# EAGLE design CC2640_interface (EAGLE 6.6.0)

## Sheet 1 of 4
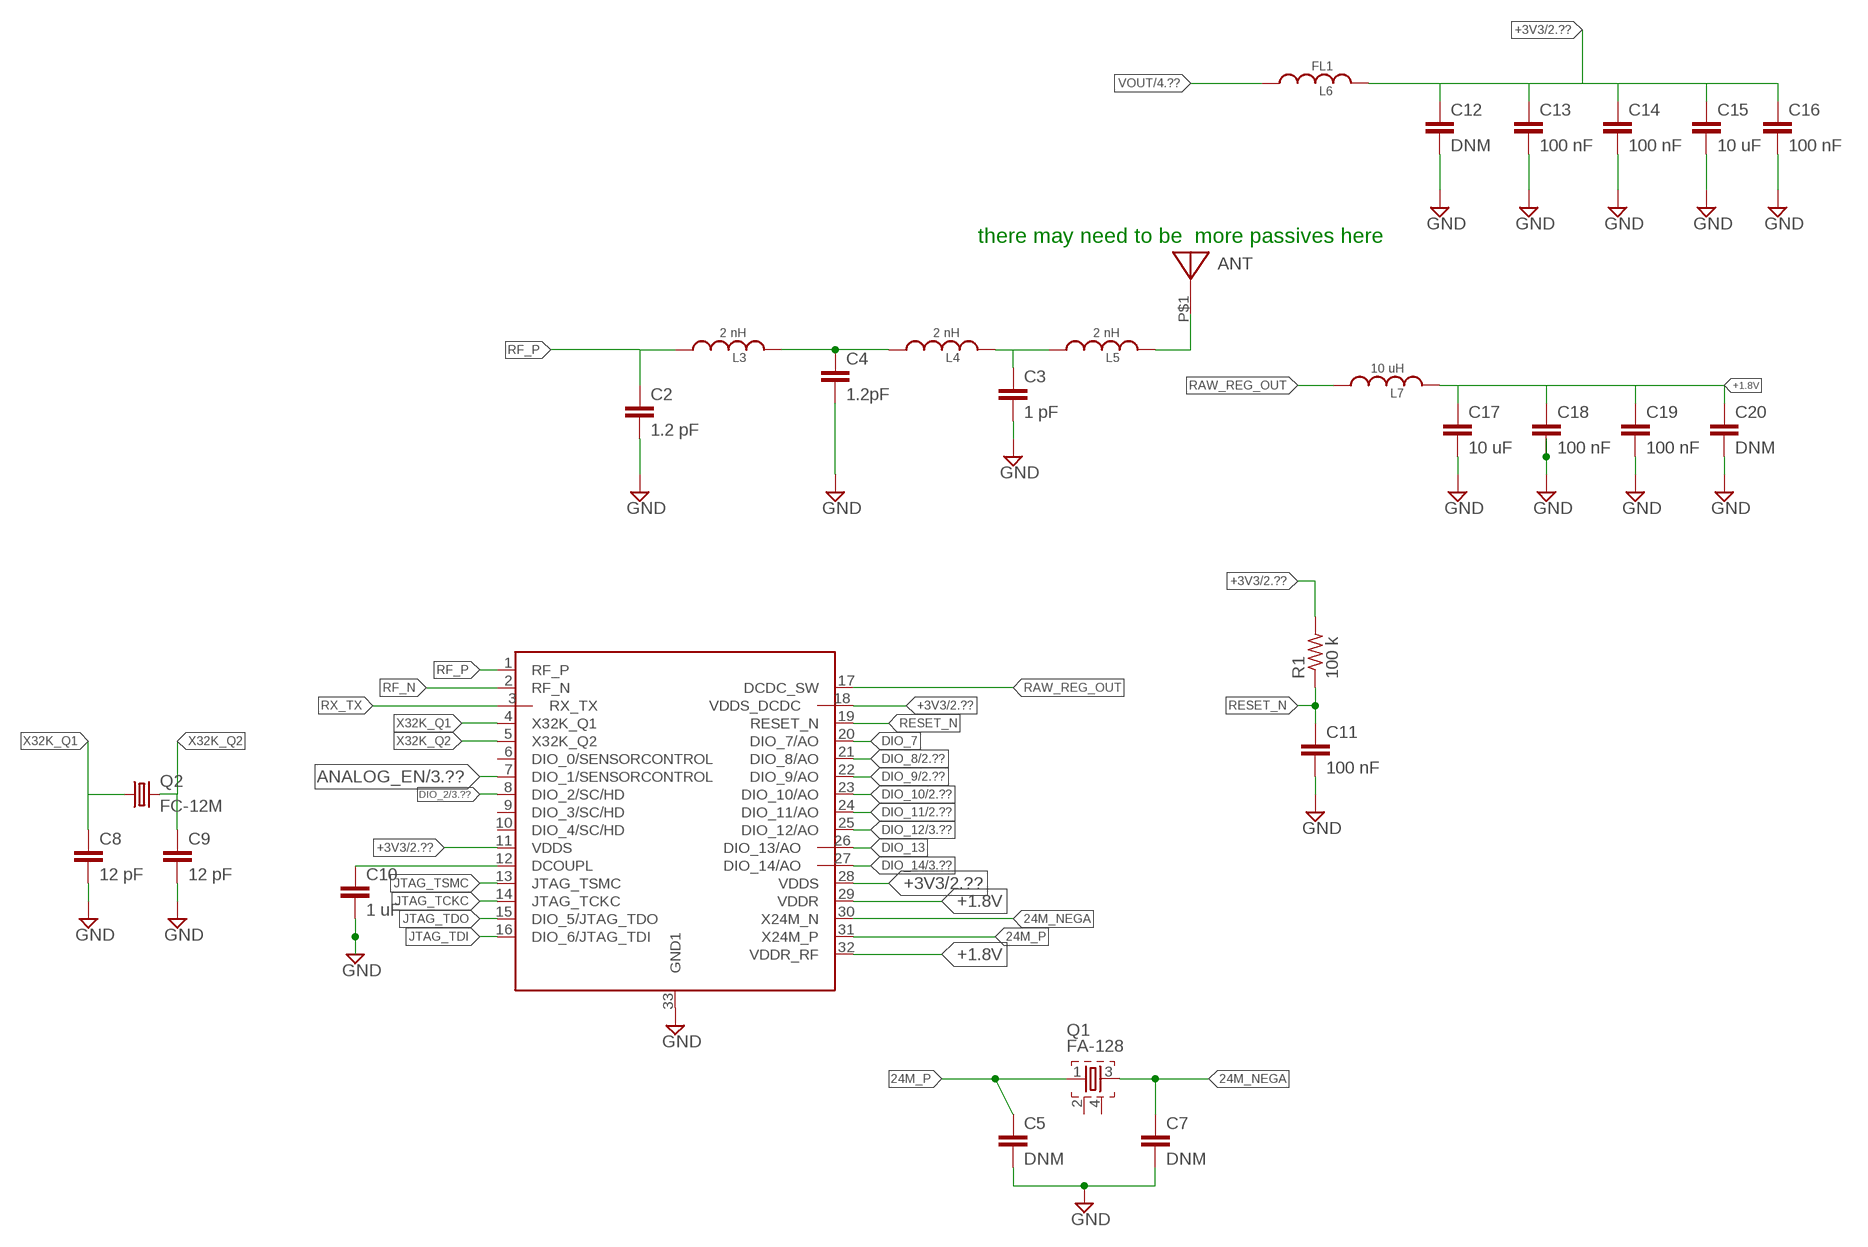
[diagram p0: schematic, sheet 1]

### Parts
ANT  2450AT18A100  [2450AT18A100]
C2  1.2 pF  C-EUC0402  [C0402]
C3  1 pF  C-EUC0402  [C0402]
C4  1.2pF  C-EUC0402  [C0402]
C5  DNM  C-EUC0402  [C0402]
C7  DNM  C-EUC0402  [C0402]
C8  12 pF  C-EUC0402  [C0402]
C9  12 pF  C-EUC0402  [C0402]
C10  1 uF  C-EUC0402  [C0402]
C11  100 nF  C-EUC0402  [C0402]
C12  DNM  C-EUC0402  [C0402]
C13  100 nF  C-EUC0402  [C0402]
C14  100 nF  C-EUC0402  [C0402]
C15  10 uF  C-EUC0402  [C0402]
C16  100 nF  C-EUC0402  [C0402]
C17  10 uF  C-EUC0402  [C0402]
C18  100 nF  C-EUC0402  [C0402]
C19  100 nF  C-EUC0402  [C0402]
C20  DNM  C-EUC0402  [C0402]
L3  2 nH  INDUCTOR0603  [0603_CAP]
L4  2 nH  INDUCTOR0603  [0603_CAP]
L5  2 nH  INDUCTOR0603  [0603_CAP]
L6  FL1  INDUCTOR0603  [0603_CAP]
L7  10 uH  INDUCTOR0603  [0603_CAP]
Q1  FA-128  [FA-128]
Q2  FC-12M  [FC-12M]
R1  100 k  R-US_R0402  [R0402@1]
U$1  CC2640-5MM  [S-PVQFN-N32]

### Nets
24M_NEGA: C7.1 Q1.3 U$1.30(X24M_N)
24M_P: C5.1 Q1.1 U$1.31(X24M_P)
+1.8V: C17.1 C18.1 C19.1 C20.1 L7.2 U$1.29(VDDR) U$1.32(VDDR_RF)
+3V3: C12.1 C13.1 C14.1 C15.1 C16.1 L6.2 R1.2 U$1.11(VDDS) U$1.18(VDDS_DCDC) U$1.28(VDDS) ; also sheet 2,3
ANALOG_EN: U$1.7(DIO_1/SENSORCONTROL) ; also sheet 3
DCOUPLE_ME: C10.1 U$1.12(DCOUPL)
DIO_2: U$1.8(DIO_2/SC/HD) ; also sheet 3
DIO_7: U$1.20(DIO_7/AO)
DIO_8: U$1.21(DIO_8/AO) ; also sheet 2
DIO_9: U$1.22(DIO_9/AO) ; also sheet 2
DIO_10: U$1.23(DIO_10/AO) ; also sheet 2
DIO_11: U$1.24(DIO_11/AO) ; also sheet 2,3
DIO_12: U$1.25(DIO_12/AO) ; also sheet 3
DIO_13: U$1.26(DIO_13/AO)
DIO_14: U$1.27(DIO_14/AO) ; also sheet 3
GND: C2.2 C3.2 C4.2 C5.2 C7.2 C8.2 C9.2 C10.2 C11.2 C12.2 C13.2 C14.2 C15.2 C16.2 C17.2 C18.2 C19.2 C20.2 U$1.33(GND1) ; also sheet 2,3,4
JTAG_TCKC: U$1.14(JTAG_TCKC)
JTAG_TDI: U$1.16(DIO_6/JTAG_TDI)
JTAG_TDO: U$1.15(DIO_5/JTAG_TDO)
JTAG_TSMC: U$1.13(JTAG_TSMC)
N$4: C4.1 L3.2 L4.1
N$5: C3.1 L4.2 L5.1
N$7: ANT.P$1 L5.2
RAW_REG_OUT: L7.1 U$1.17(DCDC_SW)
RESET_N: C11.1 R1.1 U$1.19(RESET_N)
RF_N: U$1.2(RF_N)
RF_P: C2.1 L3.1 U$1.1(RF_P)
RX_TX: U$1.3(RX_TX)
VOUT: L6.1 ; also sheet 4
X32K_Q1: C8.1 Q2.1 U$1.4(X32K_Q1)
X32K_Q2: C9.1 Q2.2 U$1.5(X32K_Q2)
Unconnected: Q1.2 Q1.4 U$1.6(DIO_0/SENSORCONTROL) U$1.9(DIO_3/SC/HD) U$1.10(DIO_4/SC/HD)

### Notes on the sheet
- there may need to be  more passives here

## Sheet 2 of 4
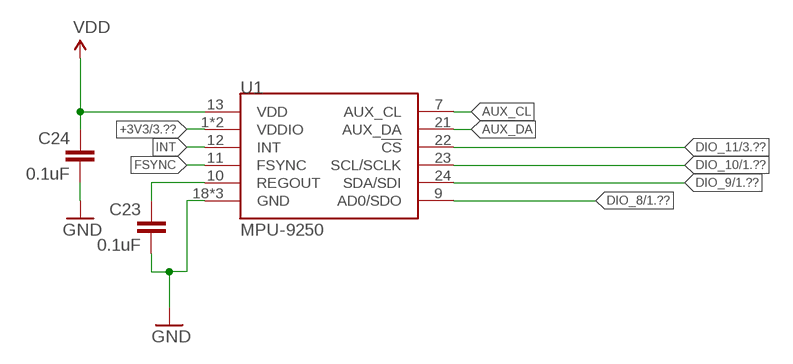
[diagram p1: schematic, sheet 2]

### Parts
C23  0.1uF  0.1UF-25V(+80/-20%)(0603)  [0603-CAP]
C24  0.1uF  0.1UF-25V(+80/-20%)(0603)  [0603-CAP]
U1  MPU-9250  [QFN24_PAD]

### Nets
+3V3: C24.1 U1.1(VDDIO) U1.8(VDDIO) U1.13(VDD) ; supply symbol labelled VDD ; also sheet 1,3
ADSD_STUB: U1.9(AD0/SDO)
AUX_CL: U1.7(AUX_CL)
AUX_DA: U1.21(AUX_DA)
DIO_9: U1.24(SDA/SDI) ; also sheet 1
DIO_10: U1.23(SCL/SCLK) ; also sheet 1
DIO_11: U1.22(!CS) ; also sheet 1,3
FSYNC: U1.11(FSYNC)
GND: C23.2 C24.2 U1.18(GND) U1.20(GND) U1.CENTER(GND) ; also sheet 1,3,4
INT: U1.12(INT)
REGOUT: C23.1 U1.10(REGOUT)

## Sheet 3 of 4
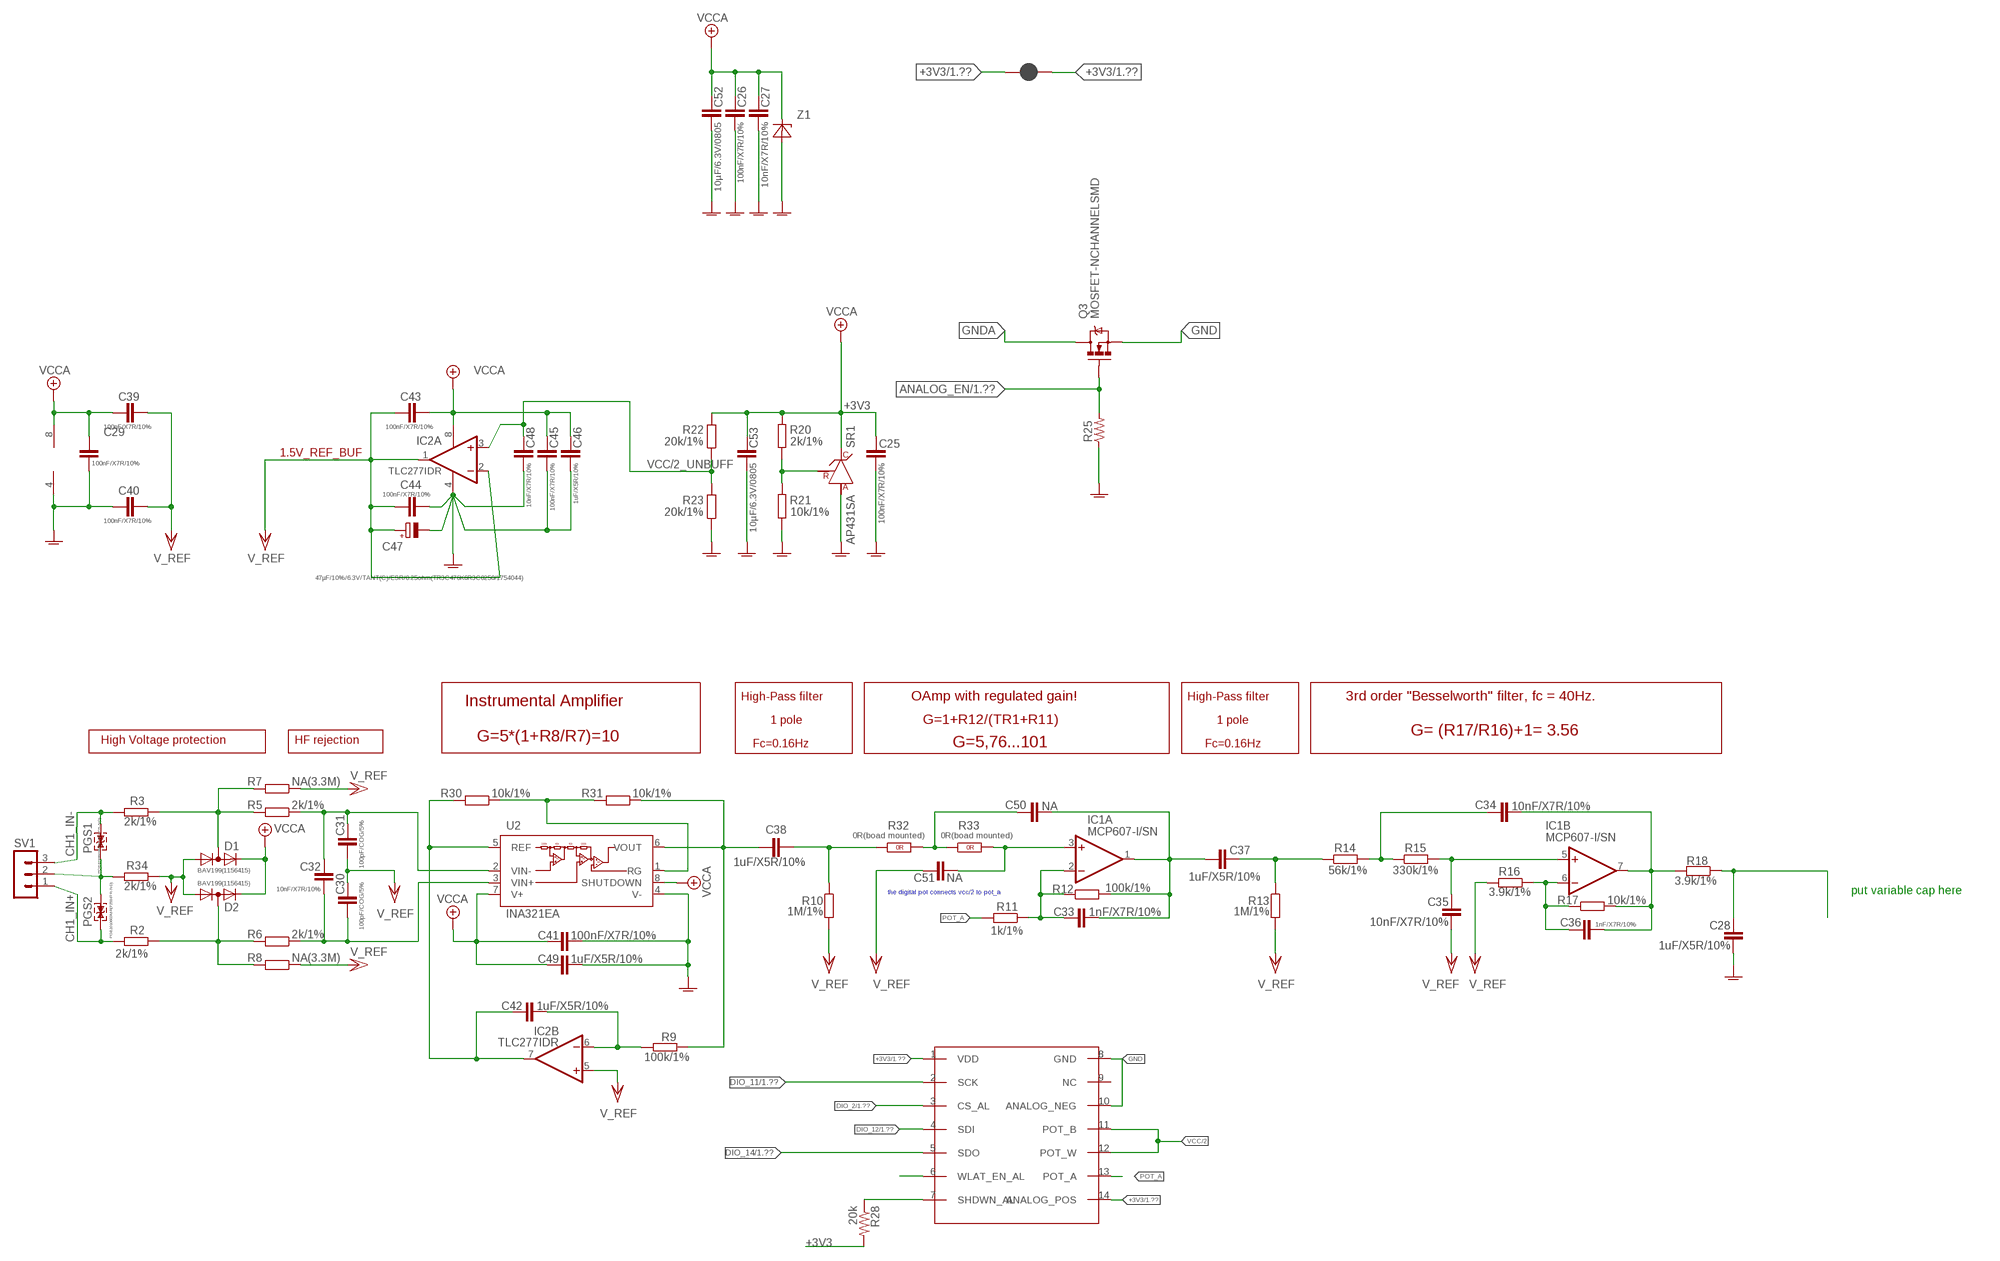
[diagram p2: schematic, sheet 3]

### Parts
C25  100nF/X7R/10%  C-EUC0603_DWS  [C0603_DWS]
C26  100nF/X7R/10%  C-EUC0603_DWS  [C0603_DWS]
C27  10nF/X7R/10%  C-EUC0603_DWS  [C0603_DWS]
C28  1uF/X5R/10%  C-EUC0603_DWS  [C0603_DWS]
C29  100nF/X7R/10%  C-EUC0603_DWS  [C0603_DWS]
C30  100pF/COG/5%  C-EUC0603_DWS  [C0603_DWS]
C31  100pF/COG/5%  C-EUC0603_DWS  [C0603_DWS]
C32  10nF/X7R/10%  C-EUC0603_DWS  [C0603_DWS]
C33  1nF/X7R/10%  C-EUC0603_DWS  [C0603_DWS]
C34  10nF/X7R/10%  C-EUC0603_DWS  [C0603_DWS]
C35  10nF/X7R/10%  C-EUC0603_DWS  [C0603_DWS]
C36  1nF/X7R/10%  C-EUC0603_DWS  [C0603_DWS]
C37  1uF/X5R/10%  C-EUC0603_DWS  [C0603_DWS]
C38  1uF/X5R/10%  C-EUC0603_DWS  [C0603_DWS]
C39  100nF/X7R/10%  C-EUC0603_DWS  [C0603_DWS]
C40  100nF/X7R/10%  C-EUC0603_DWS  [C0603_DWS]
C41  100nF/X7R/10%  C-EUC0603_DWS  [C0603_DWS]
C42  1uF/X5R/10%  C-EUC0603_DWS  [C0603_DWS]
C43  100nF/X7R/10%  C-EUC0603_DWS  [C0603_DWS]
C44  100nF/X7R/10%  C-EUC0603_DWS  [C0603_DWS]
C45  100nF/X7R/10%  C-EUC0603_DWS  [C0603_DWS]
C46  1uF/X5R/10%  C-EUC0603_DWS  [C0603_DWS]
C47  47µF/10%/6.3V/TANT(C)/ESR/0.25ohm(TR3C476K6R3C0250/1754044)  CPOL-EUCT6032  [CT6032]
C48  10nF/X7R/10%  C-EUC0603_DWS  [C0603_DWS]
C49  1uF/X5R/10%  C-EUC0603_DWS  [C0603_DWS]
C50  NA  C-EUC0603_DWS_NA  [C0603_DWS_NA]
C51  NA  C-EUC0603_DWS_NA  [C0603_DWS_NA]
C52  10µF/6.3V/0805  C-EUC0805_5MIL_DWS  [C0805_5MIL_DWS]
C53  10µF/6.3V/0805  C-EUC0805_5MIL_DWS  [C0805_5MIL_DWS]
D1  BAV199(1156415)  DIODE_AC-AC_  [SOT23C(BAT54S)]
D2  BAV199(1156415)  DIODE_AC-AC_  [SOT23C(BAT54S)]
DIG_POT  MCP41HVX1  [TSSOP-14/5MM]
IC1  MCP607-I/SN  LM358D  [SO08]
IC2  TLC277IDR  LM358D  [SO08]
PGS1  PGB1010603MR(F2594TR-ND)  [0603]
PGS2  PGB1010603MR(F2594TR-ND)  [0603]
Q3  MOSFET-NCHANNELSMD  [SOT23-3]
R2  2k/1%  R-EU_R0603_5MIL_DWS  [R0603_5MIL_DWS]
R3  2k/1%  R-EU_R0603_5MIL_DWS  [R0603_5MIL_DWS]
R5  2k/1%  R-EU_R0603_5MIL_DWS  [R0603_5MIL_DWS]
R6  2k/1%  R-EU_R0603_5MIL_DWS  [R0603_5MIL_DWS]
R7  NA(3.3M)  R-EU_R0603_5MIL_DWS_NA  [R0603_5MIL_DWS_NA]
R8  NA(3.3M)  R-EU_R0603_5MIL_DWS_NA  [R0603_5MIL_DWS_NA]
R9  100k/1%  R-EU_R0603_5MIL_DWS  [R0603_5MIL_DWS]
R10  1M/1%  R-EU_R0603_5MIL_DWS  [R0603_5MIL_DWS]
R11  1k/1%  R-EU_R0603_5MIL_DWS  [R0603_5MIL_DWS]
R12  100k/1%  R-EU_R0603_5MIL_DWS  [R0603_5MIL_DWS]
R13  1M/1%  R-EU_R0603_5MIL_DWS  [R0603_5MIL_DWS]
R14  56k/1%  R-EU_R0603_5MIL_DWS  [R0603_5MIL_DWS]
R15  330k/1%  R-EU_R0603_5MIL_DWS  [R0603_5MIL_DWS]
R16  3.9k/1%  R-EU_R0603_5MIL_DWS  [R0603_5MIL_DWS]
R17  10k/1%  R-EU_R0603_5MIL_DWS  [R0603_5MIL_DWS]
R18  3.9k/1%  R-EU_R0603_5MIL_DWS  [R0603_5MIL_DWS]
R20  2k/1%  R-EU_R0603_5MIL_DWS  [R0603_5MIL_DWS]
R21  10k/1%  R-EU_R0603_5MIL_DWS  [R0603_5MIL_DWS]
R22  20k/1%  R-EU_R0603_5MIL_DWS  [R0603_5MIL_DWS]
R23  20k/1%  R-EU_R0603_5MIL_DWS  [R0603_5MIL_DWS]
R25  RESISTOR0603_RES  [0603-RES]
R28  20k  RESISTOR0402-RES  [0402-RES]
R30  10k/1%  R-EU_R0603_5MIL_DWS  [R0603_5MIL_DWS]
R31  10k/1%  R-EU_R0603_5MIL_DWS  [R0603_5MIL_DWS]
R32  0R(boad mounted)  R_0R0R(NA)  [0603_0R]
R33  0R(boad mounted)  R_0R0R(NA)  [0603_0R]
R34  2k/1%  R-EU_R0603_5MIL_DWS  [R0603_5MIL_DWS]
SJ3  JUMPER-PAD-2-NC_BY_PASTEFULL-BOX-SILK  [PAD-JUMPER-2-NC_BY_PASTE_YES_SILK_FULL_BOX]
SR1  AP431SA  TL431'''  [SOT-23]
SV1  MA03-1  [MA03-1]
U2  INA321EA  [MSOP8]
Z1  BZV55C6V2  ZDIOD-SMD  [MINI-MELF]

### Nets
+3V3: C25.1 C26.1 C27.1 C29.1 C39.1 C41.1 C43.2 C45.1 C46.1 C49.1 C52.1 C53.1 D1.2(K) D2.2(K) DIG_POT.1(VDD) DIG_POT.14(ANALOG_POS) IC1.8(P:V+) IC2.8(P:V+) R20.2 R22.2 R28.2 SJ3.1 SJ3.2 SR1.1(C) U2.7(V+) U2.8(SHUTDOWN) Z1.1(C) ; supply symbol labelled VCCA ; also sheet 1,2
ADC0: C28.1 R18.1
ANALOG_EN: Q3.1(G) R25.2 ; also sheet 1
CH1_IN+: PGS2.1 R2.1 SV1.1
CH1_IN-: PGS1.2 R3.1 SV1.3
DIO_2: DIG_POT.3(CS_AL) ; also sheet 1
DIO_11: DIG_POT.2(SCK) ; also sheet 1,2
DIO_12: DIG_POT.4(SDI) ; also sheet 1
DIO_14: DIG_POT.5(SDO) ; also sheet 1
GND: DIG_POT.8(GND) DIG_POT.10(ANALOG_NEG) Q3.2(S) R25.1 ; also sheet 1,2,4
GNDA: C25.2 C26.2 C27.2 C28.2 C29.2 C40.1 C41.2 C44.2 C45.2 C46.2 C47.- C48.2 C49.2 C52.2 C53.2 IC1.4(P:V-) IC2.4(P:V-) Q3.3(D) R21.1 R23.1 SR1.3(A) U2.4(V-) Z1.2(A)
N$1: D1.3(AK) R3.2 R5.2 R7.2
N$6: DIG_POT.6(WLAT_EN_AL)
N$8: D2.3(AK) R2.2 R6.2 R8.2
N$9: C42.2 IC2.7(B:OUT) R30.2 U2.5(REF)
N$10: R30.1 R31.2 U2.1(RG)
N$22: R20.1 R21.2 SR1.2(R)
N$37: C38.2 R10.1 R32.1(1.1)
N$38: C50.1 R32.2(1.2) R33.1(1.1)
N$39: PGS1.1 PGS2.2 R34.1 SV1.2
N$81: C37.2 R13.1 R14.1
N$83: C38.1 R9.2 R31.1 U2.6(VOUT)
N$92: C30.1 C32.1 R6.1 U2.3(VIN+)
N$93: C31.2 C32.2 R5.1 U2.2(VIN-)
N$102: C51.1 IC1.3(A:+IN) R33.2(1.2)
N$104: C33.2 C37.1 C50.2 IC1.1(A:OUT) R12.2
N$105: C33.1 IC1.2(A:-IN) R11.1 R12.1
N$107: C35.1 IC1.5(B:+IN) R15.2
N$108: C34.1 R14.2 R15.1
N$109: C34.2 C36.2 IC1.7(B:OUT) R17.2 R18.2
N$110: C36.1 IC1.6(B:-IN) R16.1 R17.1
N$145: C42.1 IC2.6(B:-IN) R9.1
POT_A: DIG_POT.13(POT_A) R11.2
SHDWN_AL: DIG_POT.7(SHDWN_AL) R28.1
VCC/2: C30.2 C31.1 C35.2 C39.2 C40.2 C43.1 C44.1 C47.+ C51.2 D1.1(A) D2.1(A) DIG_POT.11(POT_B) DIG_POT.12(POT_W) IC2.1(A:OUT) IC2.2(A:-IN) IC2.5(B:+IN) R7.1 R8.1 R10.2 R13.2 R16.2 R34.2 ; supply symbol labelled V_REF
VCC/2_UNBUFF: C48.1 IC2.3(A:+IN) R22.1 R23.2
Unconnected: DIG_POT.9(NC)

### Notes on the sheet
- 1.5V_REF_BUF
- High-Pass filter | OAmp with regulated gain! | High-Pass filter | 3rd order "Besselworth" filter, fc = 40Hz.
- Instrumental Amplifier
- 1 pole | G=1+R12/(TR1+R11) | 1 pole
- High Voltage protection | HF rejection | G= (R17/R16)+1= 3.56
- G=5*(1+R8/R7)=10
- Fc=0.16Hz | G=5,76...101 | Fc=0.16Hz
- the digital pot connects vcc/2 to pot_a | put variable cap here

## Sheet 4 of 4
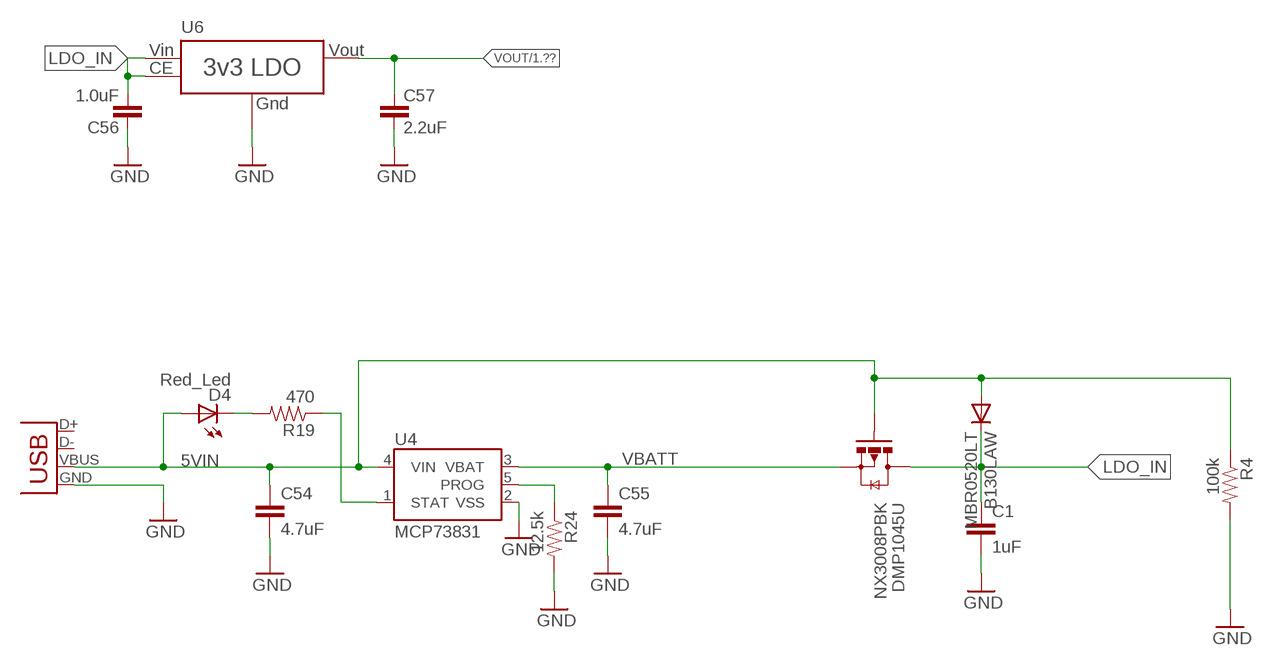
[diagram p3: schematic, sheet 4]

### Parts
B130LAW  MBR0520LT  [SOD123]
C1  1uF  CAP0402-CAP  [0402-CAP]
C54  4.7uF  CAP0402-CAP  [0402-CAP]
C55  4.7uF  CAP0402-CAP  [0402-CAP]
C56  1.0uF  C-EUC0805  [C0805]
C57  2.2uF  C-EUC0805  [C0805]
D4  Red_Led  LED0603  [LED-0603]
DMP1045U  NX3008PBK  [SOT23-3]
R4  100k  RESISTOR0402-RES  [0402-RES]
R19  470  RESISTOR0402-RES  [0402-RES]
R24  12.5k  RESISTOR0402-RES  [0402-RES]
U4  MCP73831  [SOT23-5]
U6  XC6210  [SOT-25]
X1  USB-MICROB  [USB-MICROB]

### Nets
5VIN: B130LAW.A C54.1 D4.A DMP1045U.1(G) R4.1 U4.4(VIN) X1.VBUS
GND: C1.2 C54.2 C55.2 C56.1 C57.2 R4.2 R24.2 U4.2(VSS) U6.2(GND) X1.GND ; also sheet 1,2,3
LDO_IN: B130LAW.C C1.1 C56.2 DMP1045U.3(D) U6.1(VIN) U6.3(CE)
N$2: R24.1 U4.5(PROG)
N$3: D4.C R19.2
N$14: R19.1 U4.1(STAT)
VBATT: C55.1 DMP1045U.2(S) U4.3(VBAT)
VOUT: C57.1 U6.5(VOUT) ; also sheet 1
Unconnected: X1.D+ X1.D-

## Library data of the parts
ANT = Johanson_antenna:2450AT18A100
B130LAW = diode:MBR0520LT: SCHOTTKY BARRIER RECTIFIER Source: http://onsemi.com .. MBR0520LT1-D.pdf
C1 C54 C55 = SparkFun:CAP: Capacitor Standard 0603 ceramic capacitor, and 0.1" leaded capacitor.
C2-C5 C7-C20 C25-C46 C48-C53 = rcl:C-EU: CAPACITOR, European symbol
C23 C24 = SparkFun-Capacitors:0.1UF-25V(+80/-20%)(0603): CAP-00810 Ceramic Standard decoupling cap; PROD_ID: CAP-00810
C47 = rcl:CPOL-EU: POLARIZED CAPACITOR, European symbol
C56 C57 = Jon_LIB:C-EU: CAPACITOR, European symbol
D1 D2 = semicon-smd-ipc:DIODE_AC-AC_: DUAL DIODE
D4 = SparkFun:LED: LEDs Standard schematic elements and footprints for 5mm, 3mm, 1206, and 0603 sized LEDs. 5mm - Spark Fun Electronics SKU : COM-00529 (and others)
DIG_POT = chips:MCP41HVX1
DMP1045U = fets:NX3008PBK: MOSFET - P Channel; DIGIKEY: 568-10499-1-ND; MOUSER: 771-NX3008PBK,215; NEWARK: 74T4665
IC1 IC2 = linear:LM358: OP AMP
L3-L7 = passives:INDUCTOR: A very specific inductor
PGS1 PGS2 = OLIMEX_DISCRET:PGB1010603MR: PulseGuard® Suppressors Surface Mount Polymeric ESD Suppressors
Q1 = crystal:FA-: MHz RANGE CRYSTAL UNIT Source: Epson Toyocom
Q2 = crystal:FC-12M: kHz RANGE CRYSTAL UNIT LOW PROFILE SMD Source: Epson Toyocom FC-12M.pdf
Q3 = fets:MOSFET-NCHANNEL: Generic NMOS footprint
R1 = rcl:R-US_: RESISTOR, American symbol
R2 R3 R5-R18 R20-R23 R30 R31 R34 = rcl:R-EU_: RESISTOR, European symbol
R4 R19 R24 R28 = SparkFun:RESISTOR: Resistor Basic schematic elements and footprints for 0603, 1206, and PTH resistors.
R25 = passives:RESISTOR: Resistor Basic schematic elements and footprints for 0603, 1206, and PTH resistors.
R32 R33 = OLIMEX_DISCRET:R_0R
SJ3 = SparkFun-Passives:JUMPER-PAD-2-NC_BY_PASTE
SR1 = OLIMEX_IC:TL431: TL431 Programmable Shunt Regulator Features: -> Programmable Output Voltage to 36 Volts -> Low Dynamic Output Impedance 0.20 Typical -> Sink Current Capability of 1.0 to 100mA -> Equivalent Full-Range Temperature Coefficient of 50ppm/°C Typical -> Temperature Compensated For Operation Over Full Rated Operating Temperature Range -> Low Output Noise Voltage -> Fast Turn-on Response
SV1 = con-lstb:MA03-1: PIN HEADER; OC_FARNELL: unknown; OC_NEWARK: unknown
U1 = Testing:MPU-9250: NC pin 19. 2-6 & 14-17 not internally connected. May be used for PCB trace routing.; PROD_ID: IC-13192
U2 = OLIMEX_IC:INA321
U4 = SparkFun:MCP73831: Microchip's MCP73831 Miniature single cell, fully integrated Li-Ion, Li-polymer charge management controller http://ww1.microchip.com/downloads/en/DeviceDoc/21984a.pdf
U6 = MAAV:XC6210; DIGIKEY#: 893-1075-1-ND
U$1 = chips:CC2640-5MM
X1 = SparkFun:USB: USB Connectors USB-B-PTH is fully proven SKU : PRT-00139 USB-miniB is fully proven SKU : PRT-00587 USB-A-PCB is untested. USB-A-H is throughly reviewed, but untested. Spark Fun Electronics SKU : PRT-00437 USB-B-SMT is throughly reviewed, but untested. Needs silkscreen touching up. USB-A-S has not been used/tested USB-MB-H has not been used/tested
Z1 = gogo:ZDIOD-SMD

## Net classes
1 pwr: width 0.4 mm, drill 0.6 mm, clearance 0.23 mm

## Board
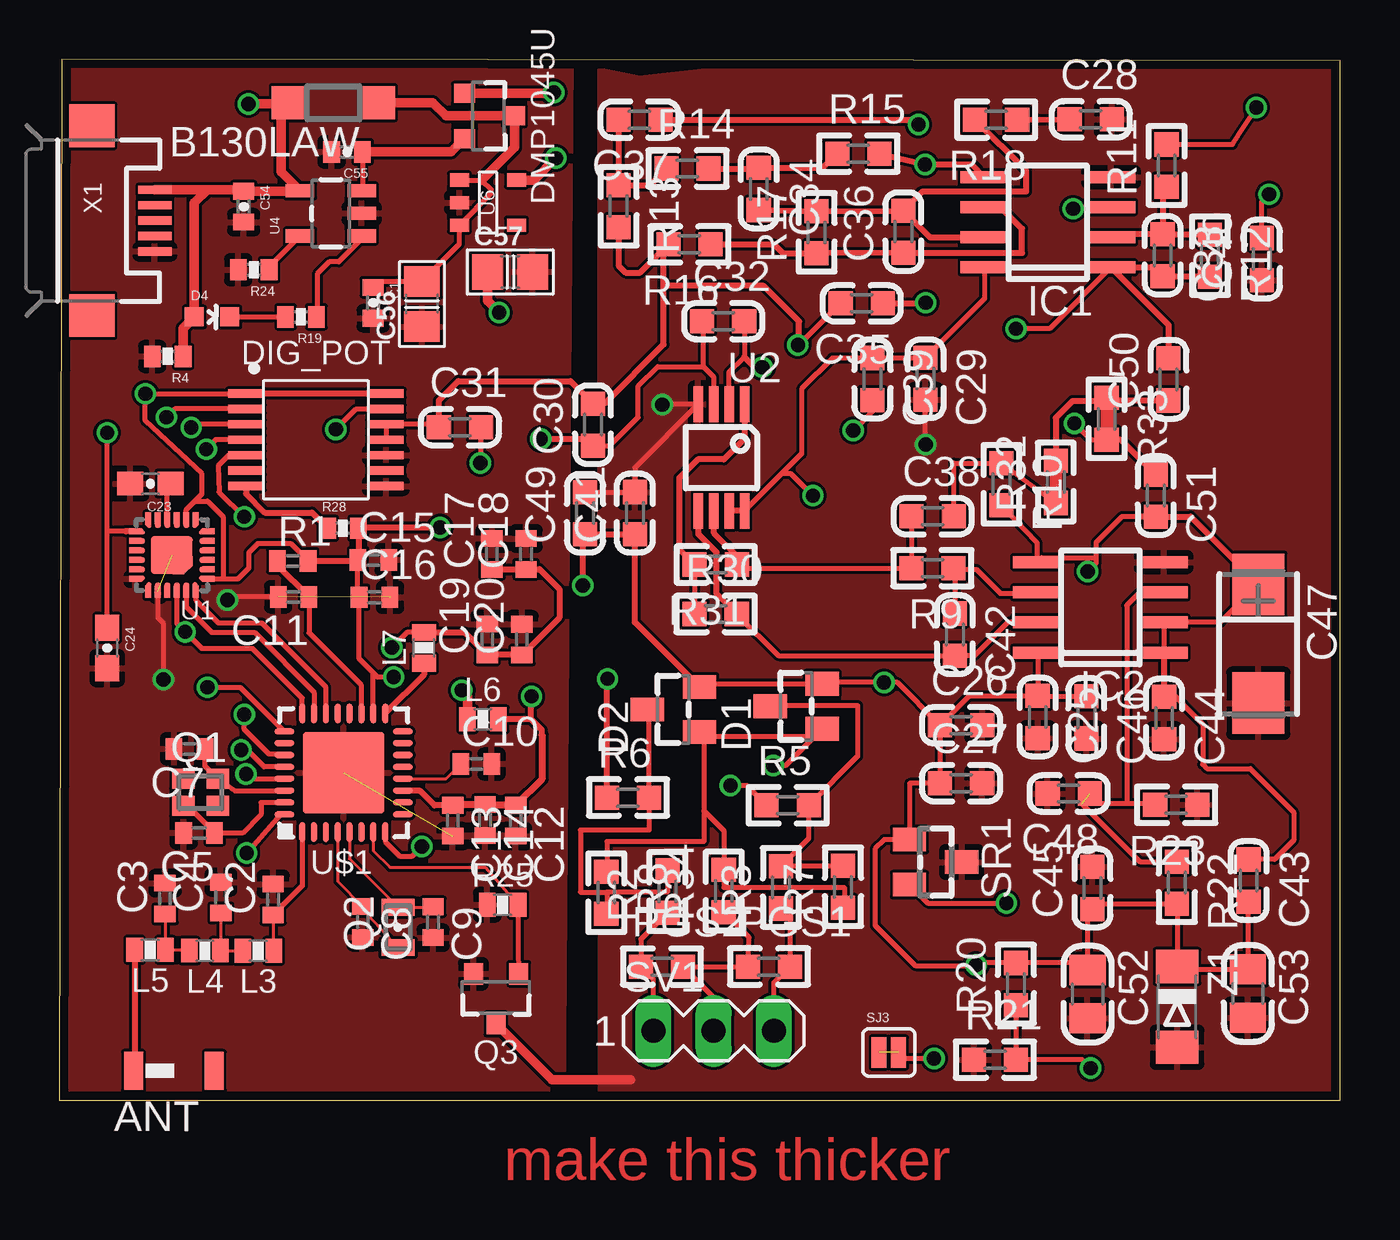
[diagram p4: board, top side]
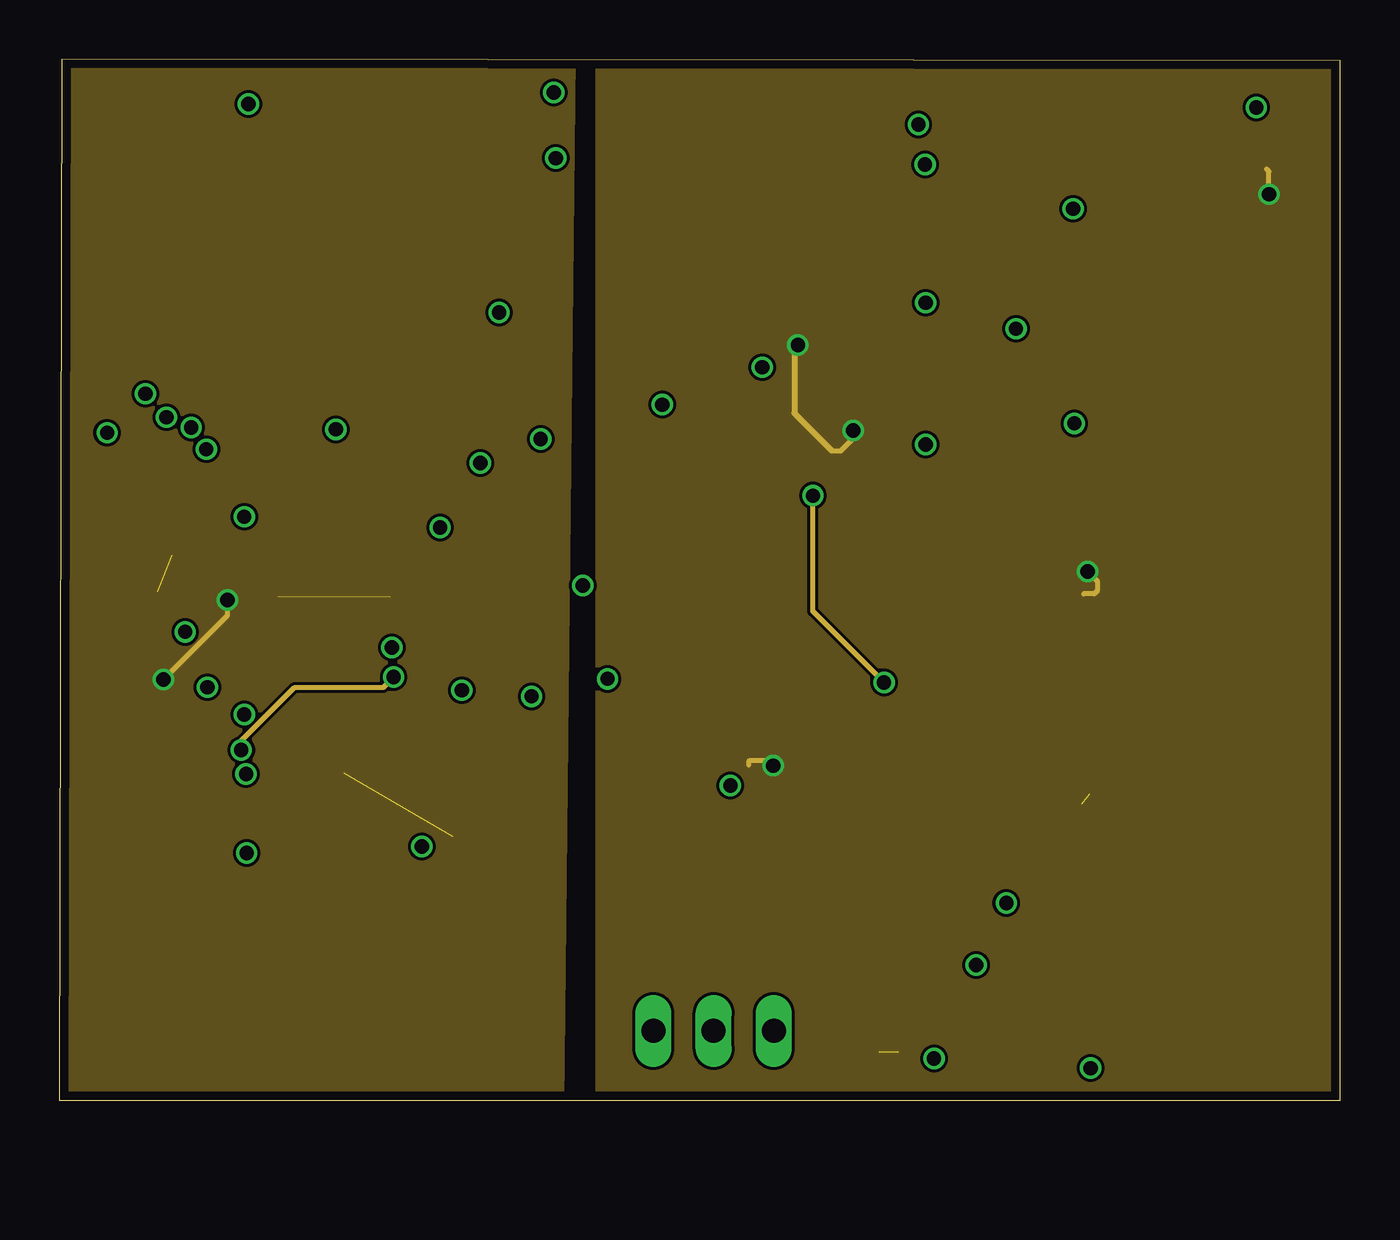
[diagram p5: board, inner layer Route2]
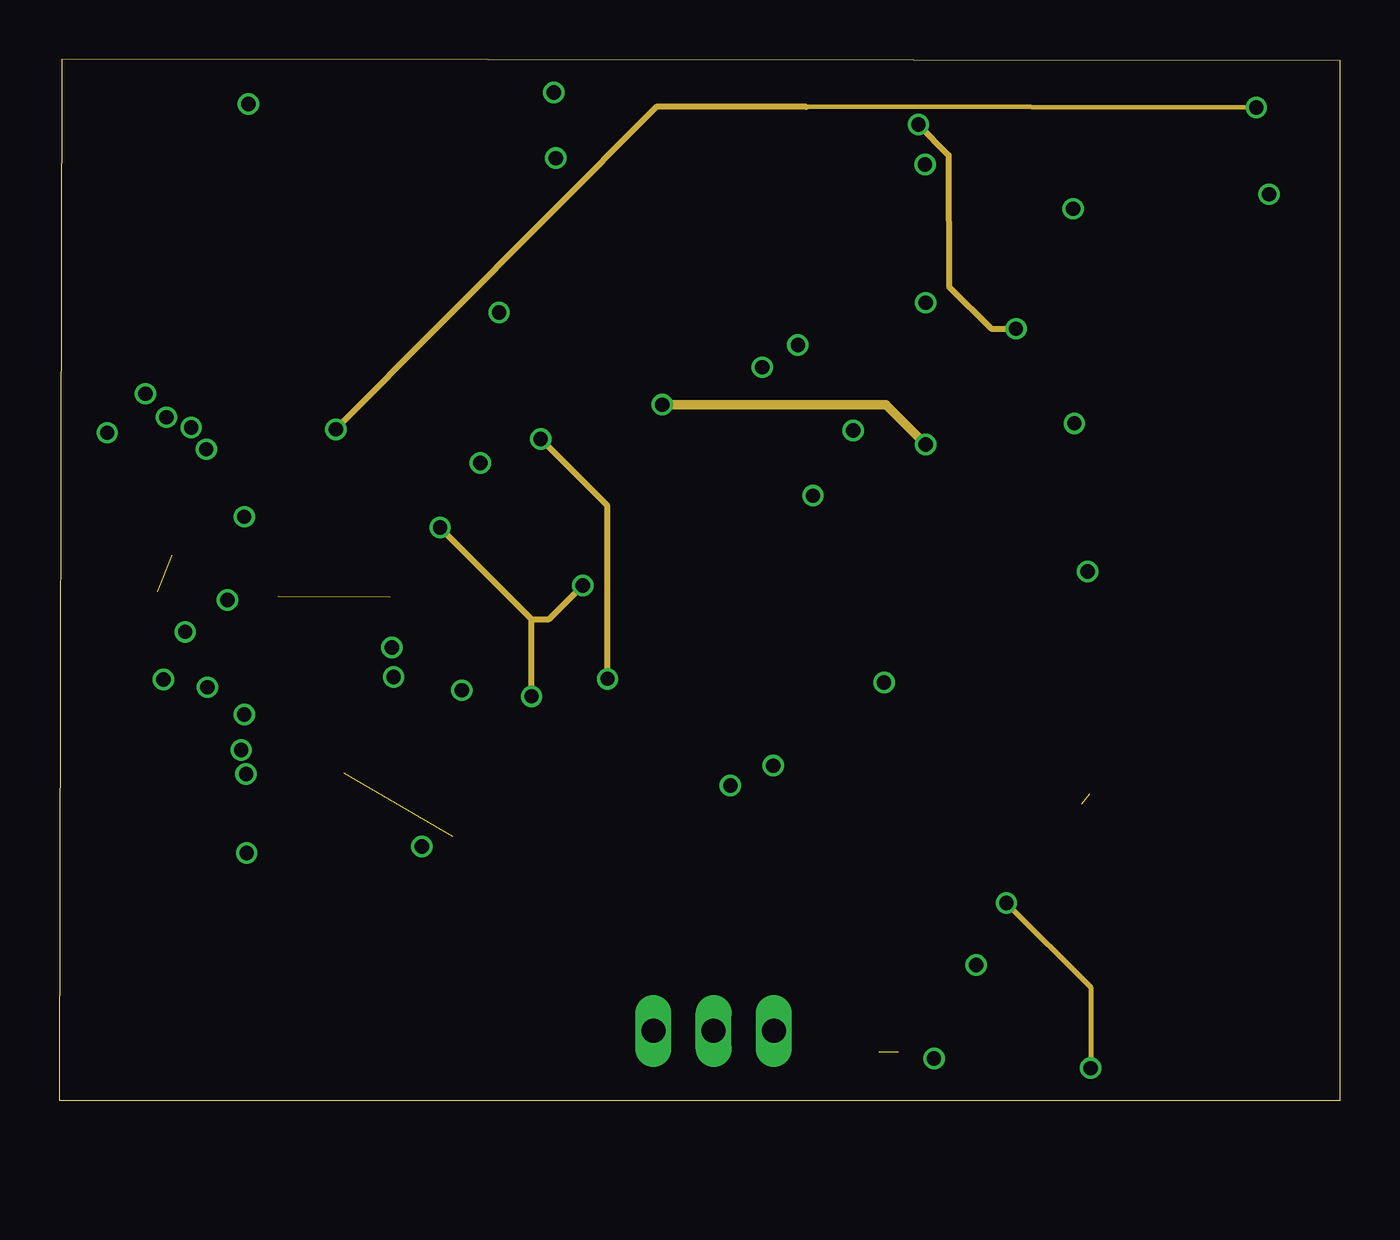
[diagram p6: board, inner layer Route15]
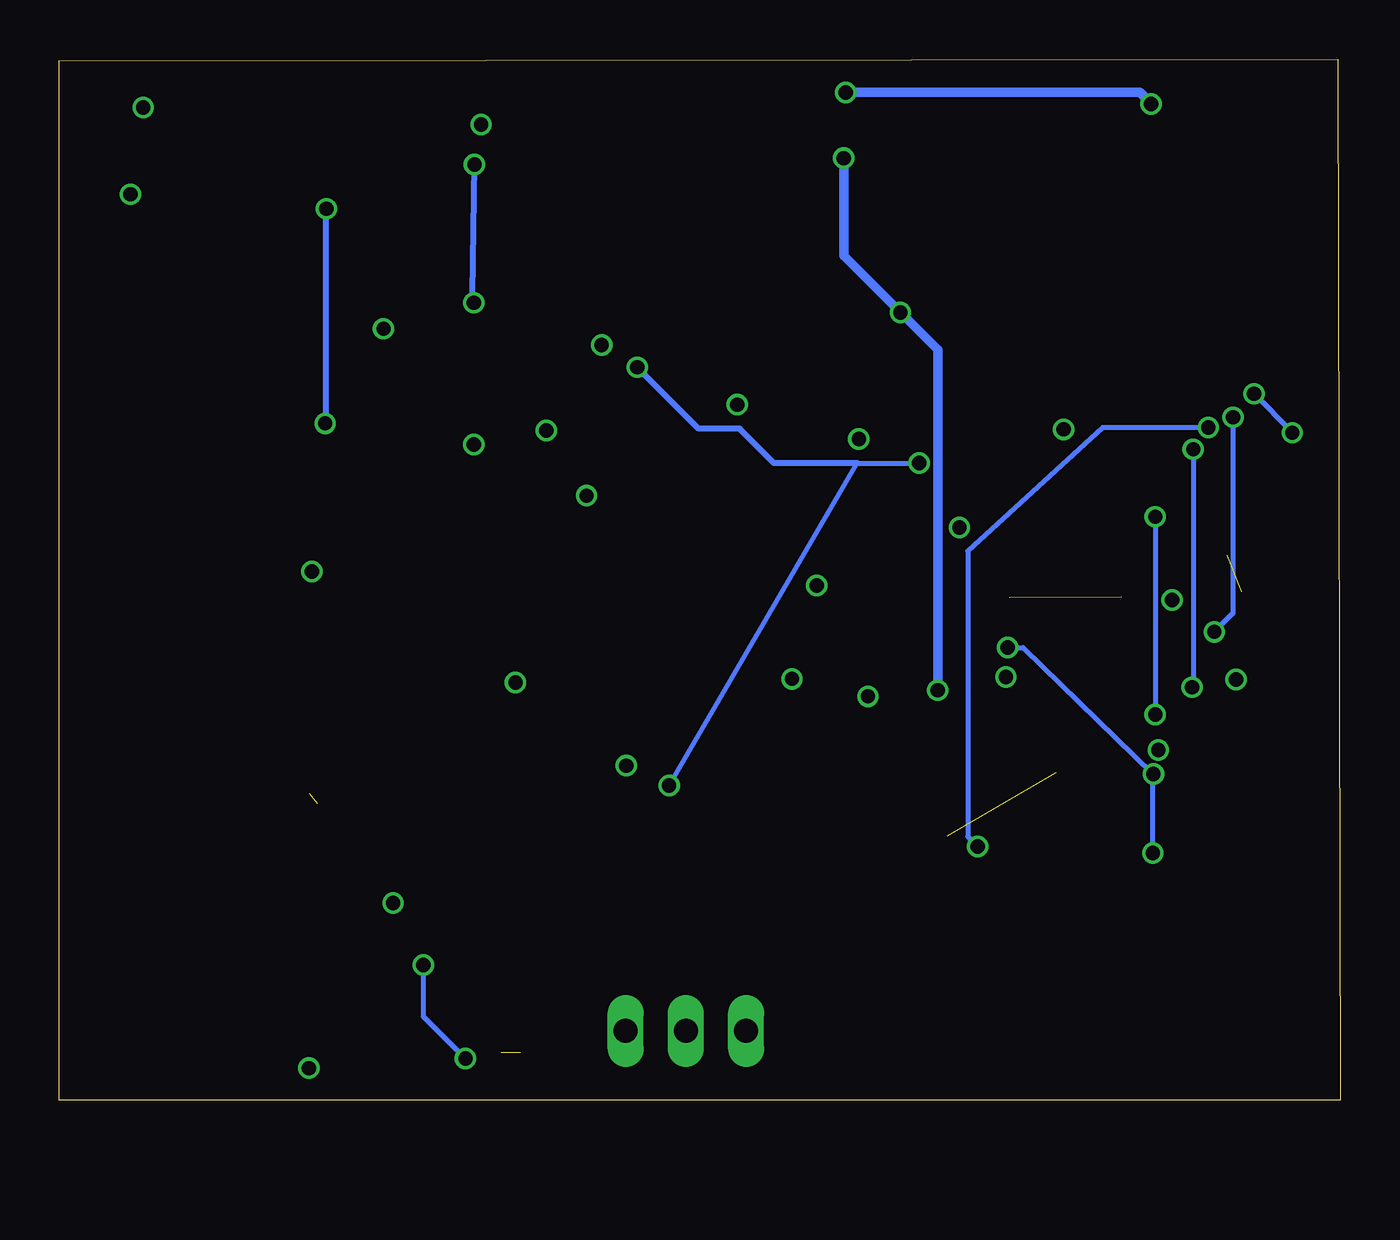
[diagram p7: board, bottom side, seen from below]

Size 54.01 x 43.87 mm. Coordinates in mm from the lower left corner, seen from the top.
Outline: 0,0 54.01,0 54.01,43.81 0.1,43.87 0,0
Copper layers (1*2*15*16): Top 0.035559375mm / dielectric 0.17018125mm / Route2 0.01778125mm / dielectric 47mil / Route15 0.01778125mm / dielectric 0.17018125mm / Bottom 0.035559375mm
Design rules "OSHPark-4layer": minimum track width 5mil, minimum drill 10mil, track to track 5mil, track to pad 5mil, pad to pad 5mil, via to via 5mil, smd to smd 5mil, copper to edge 15mil, drill to drill 6mil, minimum pad ring 4mil, minimum via ring 4mil, stop-mask expansion 2.5mil, vias tented up to drill 0mil, thermal gap 10mil

### Footprints (pad centres in the part's own frame; a part is rotated, then mirrored left to right if it is on the bottom)
2450AT18A100 = smd 0.8 x 1.6: P$1 -1.7,0; P$2 1.7,0
SOD123 = smd 1.4 x 1.4: A 1.9,0; C -1.9,0
0402-CAP = smd 0.7 x 0.9: 1 -0.65,0; 2 0.65,0
C0402 = smd 0.7 x 0.9: 1 -0.65,0; 2 0.65,0
0603-CAP = smd 1.1 x 1: 1 -0.85,0; 2 0.85,0
C0603_DWS = smd 1.016 x 1.016: 1 -0.889,0; 2 0.889,0
CT6032 = smd 2.6 x 2.2: + -2.5,0; - 2.5,0
C0603_DWS_NA = smd 1.016 x 1.016: 1 -0.889,0; 2 0.889,0
C0805_5MIL_DWS = smd 1.27 x 1.524: 1 -1.016,0; 2 1.016,0
C0805 = smd 1.3 x 1.5: 1 -0.95,0; 2 0.95,0
SOT23C(BAT54S) = smd 1 x 1.4: 1 -0.95,-1.1; 2 0.95,-1.1; 3 0,1.1
LED-0603 = smd 0.8 x 0.8: A 0,-0.75; C 0,0.75
TSSOP-14/5MM = smd 1.5 x 0.35: 1 -2.95,1.95; 2 -2.95,1.3; 3 -2.95,0.65; 4 -2.95,0; 5 -2.95,-0.65; 6 -2.95,-1.3; 7 -2.95,-1.95; 8 2.95,-1.95; 9 2.95,-1.3; 10 2.95,-0.65; 11 2.95,0; 12 2.95,0.65; 13 2.95,1.3; 14 2.95,1.95
SOT23-3 = smd 0.8 x 0.9: 1 -0.95,-1; 2 0.95,-1; 3 0,1.1
SO08 = smd 0.508 x 2.032: 1 -1.905,-2.667; 2 -0.635,-2.667; 3 0.635,-2.667; 4 1.905,-2.667; 5 1.905,2.667; 6 0.635,2.667; 7 -0.635,2.667; 8 -1.905,2.667
0603_CAP = smd 0.7 x 1: 1 -0.65,0; 2 0.65,0
0603 = smd 1.016 x 1.016: 1 -0.889,0; 2 0.889,0
FA-128 = smd 0.95 x 0.85: 1 -0.725,-0.575; 2 0.725,-0.575; 3 0.725,0.575; 4 -0.725,0.575
FC-12M = smd 0.7 x 1.4: 1 -0.85,0; 2 0.85,0
R0402@1 = smd 0.7 x 0.9: 1 -0.65,0; 2 0.65,0
R0603_5MIL_DWS = smd 1.016 x 1.016: 1 -0.889,0; 2 0.889,0
0402-RES = smd 0.7 x 0.9: 1 -0.65,0; 2 0.65,0
R0603_5MIL_DWS_NA = smd 1.016 x 1.016: 1 -0.889,0; 2 0.889,0
0603-RES = smd 0.7 x 1: 1 -0.65,0; 2 0.65,0
0603_0R = smd 1.016 x 1.016: 1 -0.889,0; 2 0.889,0
PAD-JUMPER-2-NC_BY_PASTE_YES_SILK_FULL_BOX = smd 0.635 x 1.27: 1 -0.412,0; 2 0.412,0
SOT-23 = smd 1 x 1.4: 1 -0.95,-1.1; 2 0.95,-1.1; 3 0,1.1
MA03-1 = drill 1.016 long: 1 -2.54,0; 2 0,0; 3 2.54,0
QFN24_PAD = smd 0.5 x 0.25: 1 -1.55,1; 2 -1.55,0.6; 3 -1.55,0.2; 4 -1.55,-0.2; 5 -1.55,-0.6; 6 -1.55,-1; 13 1.55,-1; 14 1.55,-0.6; 15 1.55,-0.2; 16 1.55,0.2; 17 1.55,0.6; 18 1.55,1 | smd 0.08 x 0.13: 1$1 -1.32,1.06; 1$3 -1.26,0.94; P$33 1.26,-0.94; P$34 1.32,-1.06; P$58 1.26,0.94; P$59 1.32,1.06; P$68 -1.26,-0.94; P$69 -1.32,-1.06 | smd 0.1 x 0.185 rotated 45: 1$2 -1.25,1.024; P$49 1.024,-1.25 | smd 0.14 x 0.14: 1$4 -1.22,0.945; P$23 -0.945,-1.22; P$24 1.22,-0.945; P$36 0.945,1.22; P$51 0.945,-1.22; P$56 1.22,0.945; P$61 -0.945,1.22; P$66 -1.22,-0.945 | smd 0.05 x 0.05: 1$5 -1.175,0.97; P$25 -0.97,-1.175; P$31 1.175,-0.97; P$37 0.97,1.175; P$52 0.97,-1.175; P$57 1.175,0.97; P$62 -0.97,1.175; P$67 -1.175,-0.97 | smd 0.25 x 0.5: 7 -1,-1.55; 8 -0.6,-1.55; 9 -0.2,-1.55; 10 0.2,-1.55; 11 0.6,-1.55; 12 1,-1.55; 19 1,1.55; 20 0.6,1.55; 21 0.2,1.55; 22 -0.2,1.55; 23 -0.6,1.55; 24 -1,1.55 | smd 0.25 x 0.25: CENTER 0,0 | smd 0.4 x 0.4: DBBADFE -0.675,0.24 | smd 0.6 x 1.2: DBBADFE1 -0.575,-0.195 | smd 0.25 x 0.3: P$1 -0.2,1.3; P$3 0.2,1.3; P$5 0.6,1.3; P$11 -0.6,1.3; P$16 0.2,-1.3; P$18 -0.2,-1.3; P$20 -0.6,-1.3; P$26 0.6,-1.3 | smd 0.3 x 0.25: P$2 -1.3,0.2; P$4 -1.3,0.6; P$28 -1.3,-0.2; P$38 -1.3,-0.6; P$40 1.3,0.2; P$42 1.3,-0.2; P$44 1.3,-0.6; P$50 1.3,0.6 | smd 0.1 x 0.185 rotated 225: P$7 1.25,-1.024; P$60 -1.024,1.25 | smd 1.1 x 1.59: P$13 0.325,0 | smd 0.3 x 0.5 rotated 315: P$14 -0.592,0.512 | smd 0.5 x 1.59: P$15 -0.27,0 | smd 0.1 x 0.185 rotated 135: P$22 -1.024,-1.25; P$55 1.25,1.024 | smd 0.13 x 0.08: P$27 -0.94,-1.26; P$29 -1.06,-1.32; P$39 0.94,1.26; P$41 1.06,1.32; P$53 0.94,-1.26; P$54 1.06,-1.32; P$63 -0.94,1.26; P$64 -1.06,1.32 | smd 0.1 x 0.185 rotated 315: P$35 1.024,1.25; P$65 -1.25,-1.024
MSOP8 = smd 0.4 x 1.5: 1 -0.975,-2.25; 2 -0.325,-2.25; 3 0.325,-2.25; 4 0.975,-2.25; 5 0.975,2.25; 6 0.325,2.25; 7 -0.325,2.25; 8 -0.975,2.25
SOT23-5 = smd 0.55 x 1.2: 1 -0.95,-1.3; 2 0,-1.3; 3 0.95,-1.3; 4 0.95,1.3; 5 -0.95,1.3
SOT-25 = smd 0.55 x 0.8: 1 -0.95,-1.2; 2 0,-1.2; 3 0.95,-1.2; 4 0.95,1.2; 5 -0.95,1.2
S-PVQFN-N32 = smd 0.26 x 0.85: 1 -0.48,-2.5; 2 0.02,-2.5; 3 0.52,-2.5; 4 1.02,-2.5; 5 1.52,-2.5; 6 2.02,-2.5; 7 2.52,-2.5; 8 3.02,-2.5; 17 3.02,2.5; 18 2.52,2.5; 19 2.02,2.5; 20 1.52,2.5; 21 1.02,2.5; 22 0.52,2.5; 23 0.02,2.5; 24 -0.48,2.5 | smd 0.85 x 0.26: 9 3.77,-1.75; 10 3.77,-1.25; 11 3.77,-0.75; 12 3.77,-0.25; 13 3.77,0.25; 14 3.77,0.75; 15 3.77,1.25; 16 3.77,1.75; 25 -1.23,1.75; 26 -1.23,1.25; 27 -1.23,0.75; 28 -1.23,0.25; 29 -1.23,-0.25; 30 -1.23,-0.75; 31 -1.23,-1.25; 32 -1.23,-1.75 | smd 3.45 x 3.45: 33 1.27,0
USB-MICROB = smd 0.35 x 1.4: D+ 0,2.65; D- -0.65,2.65; GND 1.3,2.65; ID 0.65,2.65; VBUS -1.3,2.65 | smd 1.8 x 1.9: MT1 -4,0; MT2 4,0
MINI-MELF = smd 1.4 x 1.8: 1 -1.7,0; 2 1.7,0

### Placement (x,y rotation side)
ANT  4.84,1.23 0 top
B130LAW  11.56,42.04 180 top
C1  13.23,33.6 270 top
C2  9.02,8.46 90 top
C3  4.46,8.49 90 top
C4  6.81,8.53 90 top
C5  5.9,11.26 180 top
C7  5.49,14.8 180 top
C8  12.8,7.51 270 top
C9  15.76,7.5 270 top
C10  17.58,14.17 0 top
C11  9.88,21.21 180 top
C12  19.24,11.78 270 top
C13  16.59,11.78 270 top
C14  17.95,11.8 270 top
C15  13.24,22.77 0 top
C16  13.29,21.19 0 top
C17  18.24,23.02 90 top
C18  19.68,23.02 90 top
C19  18.04,19.42 90 top
C20  19.5,19.41 90 top
C23  3.84,25.98 180 top
C24  2.02,19.05 270 top
C25  41.25,16.15 270 top
C26  38.02,15.8 0 top
C27  38.02,13.35 0 top
C28  43.49,41.34 0 top
C29  36.53,30.4 270 top
C30  22.5,28.47 90 top
C31  16.89,28.36 0 top
C32  27.99,32.83 0 top
C33  46.52,35.61 270 top
C34  29.49,38.4 270 top
C35  33.83,33.58 180 top
C36  35.59,36.6 90 top
C37  24.46,41.33 180 top
C38  36.82,24.61 0 top
C39  34.28,30.39 270 top
C40  50.7,35.45 90 top
C41  24.27,24.74 90 top
C42  37.76,19.62 270 top
C43  50.14,9.25 270 top
C44  46.58,16.11 270 top
C45  43.56,8.94 90 top
C46  43.3,16.13 270 top
C47  50.56,19.23 270 top
C48  42.56,12.92 180 top
C49  22.17,24.74 90 top
C50  46.77,30.38 90 top
C51  46.23,25.48 270 top
C52  43.35,4.47 270 top
C53  50.11,4.49 270 top
C54  7.78,37.66 270 top
C55  12.13,39.97 180 top
C56  15.29,33.55 90 top
C57  19.01,34.9 0 top
D1  31.07,16.6 90 top
D2  25.89,16.46 90 top
D4  6.44,33.01 270 top
DIG_POT  10.82,27.83 0 top
DMP1045U  18.08,41.48 270 top
IC1  41.68,37 90 top
IC2  43.9,20.77 90 top
L3  8.39,6.3 180 top
L4  6.14,6.3 180 top
L5  3.83,6.34 180 top
L6  17.86,16.05 0 top
L7  15.38,19.06 90 top
PGS1  29.92,5.63 0 top
PGS2  25.41,5.62 0 top
Q1  5.96,12.97 0 top
Q2  14.28,7.28 90 top
Q3  18.41,4.32 180 top
R1  9.84,22.73 0 top
R2  25.64,8.79 90 top
R3  30.43,8.96 90 top
R4  4.57,31.34 180 top
R5  30.71,12.43 0 top
R6  23.98,12.75 0 top
R7  33.04,8.99 90 top
R8  23.06,8.74 270 top
R9  36.81,22.42 180 top
R10  39.73,25.96 270 top
R11  46.69,39.39 90 top
R12  48.51,35.59 270 top
R13  23.58,37.67 270 top
R14  26.49,39.26 0 top
R15  33.69,39.89 0 top
R16  26.57,36.07 180 top
R17  31.93,36.58 90 top
R18  39.5,41.33 180 top
R19  10.19,33.01 180 top
R20  40.33,4.89 90 top
R21  39.45,1.71 0 top
R22  47.12,9.16 270 top
R23  47.09,12.45 180 top
R24  8.2,35 180 top
R25  18.69,8.23 0 top
R28  11.96,24.1 0 top
R30  27.67,20.49 0 top
R31  27.68,22.58 180 top
R32  42.01,26.05 90 top
R33  44.16,28.71 270 top
R34  28.02,8.81 90 top
SJ3  34.98,2.01 0 top
SR1  36.95,10.03 270 top
SV1  27.59,2.92 0 top
U1  4.75,22.97 180 top
U2  27.91,27.08 180 top
U4  11.45,37.37 90 top
U6  18.07,37.83 270 top
U$1  10.72,13.79 0 top
X1  1.38,37.07 270 top
Z1  47.13,3.93 270 top

### Tracks (layer width: path | path; a pad name or v marks a point on that pad's centre or on a via)
5VIN  (via drill 0.6)
  Top 0.203: B130LAW.A 9.35,41.73
  Top 0.406: X1.VBUS 6.25,38.37 | 6.25,38.37 7.71,38.37 C54.1 10.14,38.31 U4.4 9.35,39.12 9.35,41.73 | 6.25,38.37 5.69,37.81 D4.A 5.22,32.54 R4.1 | DMP1045U.1 20.81,42.43 v20.85,42.47 | v7.98,41.99 9.61,41.99 B130LAW.A
  Bottom 0.406: v20.85,42.47 8.46,42.47 v7.98,41.99
24M_NEGA
  Top 0.203: 6.72,13.87 Q1.3 | U$1.30 9.47,13.03 7.4,13.03 Q1.3 | C7.1 6.14,14.09 Q1.3
24M_P
  Top 0.203: 5.38,12.68 Q1.1 5.41,12.4 C5.1 7.72,11.25 8.51,12.04 8.51,12.55 U$1.31
+1.8V  (via drill 0.6)
  Top 0.203: C17.1 C18.1 | 18.02,18.79 C19.1 | C20.1 | L7.2 14.66,19.71 v14.02,19.07 | U$1.29 8.1,13.54 v7.87,13.74 | U$1.32 9.33,12.04 v7.9,10.41
  Top 0.254: 18.02,18.79 19.47,18.79 C20.1 21.08,20.33 21.08,21.54 20.24,22.38 C18.1 C17.1 | L7.2 17.09,19.71 C19.1
  Bottom 0.203: v14.02,19.07 13.36,19.07 v7.87,13.74 7.9,13.61 v7.9,10.41
+3V3  (via drill 0.6)  (1 unrouted)
  Top 0.127: 17.93,12.43 C14.1
  Top 0.203: v36.88,1.75 35.39,1.75 SJ3.2 | D2.2 27.12,17.55 D1.2 32.64,17.55 32.69,17.6 v34.77,17.6 35.33,17.6 C26.1 | C26.1 C27.1 35.85,13.35 SR1.1 34.78,10.98 34.39,10.59 34.39,7.37 36.09,5.66 38.63,5.66 v38.66,5.69 38.75,5.78 R20.2 43.06,5.78 C52.1 43.35,7.85 C45.1 43.78,8.27 R22.2 Z1.1 47.25,5.51 C53.1 50.11,8.34 C43.2 | IC2.8 41.25,18.84 C25.1 | C26.1 38.37,17.04 C25.1 | C25.1 41.27,17.02 C46.1 | 7.83,29.82 DIG_POT.1 | IC1.8 39.01,33.78 C29.1 34.3,31.29 C39.1 32.6,31.28 31.29,29.97 31.29,27.23 30.45,26.39 | 30.45,26.39 U2.8 | v31.77,25.48 30.86,26.39 30.45,26.39 | R1.2 9.75,23.47 8.38,23.47 8,23.09 8,22.43 7.54,21.97 6.96,21.97 | U1.1 6.96,21.97 | 12.55,22.73 12.55,21.28 C16.1 12.65,18.59 13.24,18 | U$1.18 13.24,18 | 5.71,25.25 5.35,24.88 U1.8 | 5.71,25.25 6.25,25.25 6.91,24.59 6.91,22.02 6.96,21.97 | C24.1 2.02,23.93 | 2.02,23.93 v2.02,28.13 | 7.34,29.77 7.37,29.79 7.86,29.79 DIG_POT.1 | U1.13 2.06,23.97 2.02,23.93 | DIG_POT.1 7.86,29.77 v3.63,29.77 3.63,28.63 6.02,26.39 6.02,25.55 5.71,25.25 | U$1.28 8.64,14.04 7.92,14.76 v7.67,14.76 | v14.1,17.83 13.41,17.83 13.24,18
  Top 0.254: U2.8 U2.7 | D2.2 24.27,20.14 C41.1 C49.1 22.07,23.75 v22.07,21.69 | DIG_POT.1 DIG_POT.14 | C13.1 15.82,12.43 15.21,13.03 14.51,13.03 U$1.11 | R1.2 12.55,22.73 C15.1 12.61,22.79 R28.2 12.64,24.13 v16.05,24.13 | U1.13 2.8,23.97 2.79,23.98 | 20.34,15.39 20.34,15.6 19.89,16.05 | 19.89,16.05 L6.2 | 19.89,16.05 19.89,16.99 v19.91,17.02
  Top 0.305: 20.34,15.39 20.34,13.53 C12.1 19.22,12.45 C14.1 16.61,12.45 C13.1
  Route2 0.203: v34.77,17.6 31.77,20.6 v31.77,25.48 | v7.67,14.76 7.67,15.14 9.93,17.4 13.66,17.4 v14.1,17.83
  Route15 0.254: v19.91,17.02 19.91,20.27 | 19.91,20.27 v16.05,24.13 | 19.91,20.27 20.65,20.27 v22.07,21.69
  Bottom 0.203: v38.66,5.69 38.66,3.53 v36.88,1.75 | v2.02,28.13 2.02,28.15 v3.63,29.77
ADC0
  Top 0.254: R18.1 C28.1
ANALOG_EN
  Top 0.127: U$1.7 13.24,10.51 13.95,9.8 17.97,9.8 R25.2
  Top 0.203: R25.2 19.34,6.42 Q3.1
CH1_IN+
  Top 0.203: SV1.1 25.05,5.1 PGS2.1 24.52,6.79 R2.1
CH1_IN-
  Top 0.203: SV1.3 30.13,4.95 PGS1.2 30.81,7.69 R3.1
DCOUPLE_ME
  Top 0.127: U$1.12 16.31,13.54 C10.1
DIO_2  (via drill 0.6)
  Top 0.203: U$1.8 13.74,10.9 14.35,10.29 14.88,10.29 v15.29,10.69 | DIG_POT.3 5.7,28.48 v5.56,28.35
  Bottom 0.203: v5.56,28.35 10.01,28.35 15.7,23.14 15.7,11.1 v15.29,10.69
DIO_9
  Top 0.203: U$1.22 11.23,16.31 11.23,17.42 8.53,20.12 6.71,20.12 5.75,21.07 U1.24
DIO_10
  Top 0.203: U$1.23 10.74,17.2 8.23,19.71 6.43,19.71 5.35,20.79 U1.23
DIO_11  (via drill 0.6)
  Top 0.203: DIG_POT.2 4.88,29.13 v4.52,28.78 | U$1.24 10.24,16.94 8.15,19.02 6.02,19.02 v5.31,19.74 4.95,20.09 U1.22
  Bottom 0.203: v4.52,28.78 4.52,20.52 v5.31,19.74
DIO_12  (via drill 0.6)
  Top 0.203: DIG_POT.4 6.6,27.83 v6.2,27.43 | v6.25,17.4 7.64,17.4 U$1.25
  Bottom 0.203: v6.2,27.43 6.2,17.45 v6.25,17.4
DIO_14  (via drill 0.6)
  Top 0.203: DIG_POT.5 7.14,27.18 6.71,26.75 6.73,25.63 v7.8,24.59 | U$1.27 9.46,14.58 8.84,14.58 7.8,15.62 v7.8,16.26
  Bottom 0.203: v7.8,24.59 v7.8,16.26
GND  (via drill 0.6)  (3 unrouted)
  Top 0.152: U$1.33
  Top 0.203: C11.2 7.22,21.21 v7.09,21.08 | v4.39,17.73 4.39,20.09 4.17,20.32 4.17,21.4 U1.20
  Route2 0.203: v7.09,21.08 7.09,20.42 v4.39,17.73
  pour Top: -0.05,43.87 21.56,43.97 21.21,-0.18 0.05,0.03 0.03,36.12
  pour Route2: -0.18,43.79 21.67,43.97 21.18,-0.15 0.08,-0.15
GNDA  (via drill 0.6)
  Top 0.203: C49.2 C41.2 24.27,26.66 U2.4 25.44,29.33 v25.43,29.31 | v36.52,27.64 C29.2 | Q3.3 18.42,3.22
  Top 0.406: 18.42,3.22 20.78,0.86 24.08,0.86
  Route15 0.406: v25.43,29.31 34.85,29.31 v36.52,27.64
  pour Top: 24.46,43.08 22.78,43.41 22.81,0.15 53.62,0.15 53.62,43.61 27.41,43.41 27.1,43.36
LDO_IN
  Top 0.203: C1.1 13.48,34.5 C56.2 16.87,36.09 U6.3 18.21,38.22 18.21,38.38 17.81,38.78 U6.1
  Top 0.406: 17.81,38.78 19.18,40.15 DMP1045U.3 16.31,41.48 15.75,42.04 B130LAW.C
N$1
  Top 0.203: R7.2 33.02,9.85 R3.2 31.6,11.03 R5.2 33.66,14.48 33.66,16.64 30.01,16.64 D1.3
N$2
  Top 0.203: R24.1 8.85,35.12 U4.5
N$3
  Top 0.203: D4.C R19.2
N$4
  Top 0.127: L3.2 L4.1 6.81,6.32 C4.1
N$5
  Top 0.127: C3.1 4.46,6.35 L5.1 5.46,6.33 L4.2
N$7
  Top 0.254: L5.2 3.18,1.91 ANT.P$1
N$8
  Top 0.203: D2.3 24.87,16.39 R6.2 24.87,11.38 21.97,11.38 21.97,8.76 23.09,8.76 | R2.2 25.64,8.76 23.09,8.76 | 23.09,8.76 23.09,7.85 R8.2
N$9
  Top 0.203: R30.2 30.32,18.73 C42.2 38.59,18.73 40,20.13 IC2.7
  Top 0.254: R30.2 27.71,21.34 27.71,23.09 26.95,23.85 26.95,24.82 U2.5
N$10
  Top 0.203: R31.2 R30.1
  Top 0.254: U2.1 28.89,27.87 28.02,27 26.92,27 26.14,26.21 26.14,23.23 R31.2
N$14
  Top 0.203: U4.1 12.75,36.3 11.79,35.33 11.38,35.33 10.87,34.82 10.87,33.04 R19.1
N$22  (via drill 0.6)
  Top 0.203: SR1.2 36.62,8.31 v39.93,8.31 | v43.48,1.35 43.12,1.71 R21.2 R20.1
  Route15 0.203: v39.93,8.31 43.48,4.75 v43.48,1.35
N$37
  Top 0.203: R32.1 R10.1 37.71,26.85 C38.2
N$38
  Top 0.254: R32.2 42.01,28.75 42.72,29.46 44.02,29.46 R33.1 44.27,29.49 C50.1
N$39
  Top 0.203: SV1.2 27.59,4.34 PGS2.2 PGS1.1 29.08,6.86 R34.1
N$81
  Top 0.254: R14.1 24.9,38.56 R13.1 23.57,38.58 C37.2
N$83
  Top 0.203: R31.1 28.72,22.42 R9.2 C38.1
  Top 0.254: R31.1 28.57,22.95 27.61,23.9 27.61,24.81 U2.6
N$92  (via drill 0.6)
  Top 0.203: C30.1 23.21,27.58 24.41,28.78 24.41,30.1 25.22,30.91 27.15,30.91 | 27.15,30.91 27.58,30.48 U2.3 | 27.15,30.91 27.15,32.78 C32.1
  Top 0.254: R6.1 23.09,17.73 v23.11,17.75 | v20.3,27.86 22.21,27.86 C30.1
  Route15 0.254: v23.11,17.75 23.11,25.04 v20.3,27.86
N$93  (via drill 0.6)
  Top 0.203: C32.2 28.88,31.32 28.22,30.66 28.22,29.35 U2.2 | R5.1 29,13.26 v28.3,13.26 | v17.75,26.85 17.78,26.87 C31.2
  Top 0.254: v29.64,30.89 29.31,30.89 28.88,31.32
  Bottom 0.203: v28.3,13.26 20.37,26.85 v17.75,26.85
  Bottom 0.254: 20.37,26.85 23.88,26.85 25.32,28.3 27.05,28.3 v29.64,30.89
N$102  (via drill 0.6)
  Top 0.203: v42.8,28.52 43.5,27.83 R33.2
  Top 0.254: C51.1 44.77,27.83 R33.2 | v42.75,37.57 42.81,37.63 IC1.3
  Bottom 0.254: v42.8,28.52 42.75,28.57 v42.75,37.57
N$104  (via drill 0.6)
  Top 0.203: IC1.1 41.76,32.51 v40.34,32.51
  Top 0.254: R12.2 48.51,34.72 C33.2 46.52,35.09 IC1.1 46.77,32.67 C50.2 | C37.1 36.02,41.33 v36.22,41.12
  Route15 0.254: v36.22,41.12 36.2,41.12 37.49,39.83 37.52,34.29 39.29,32.51 v40.34,32.51
N$105
  Top 0.254: R11.1 46.52,38.5 C33.1 | R12.1 46.52,36.47 C33.1 | C33.1 44.34,36.5 IC1.2
N$107  (via drill 0.6)
  Top 0.254: R15.2 v36.5,39.44 38.48,39.44 IC1.5 | C35.1 36.52,33.58 v36.52,33.6
  Bottom 0.254: v36.52,33.6 36.58,33.98 v36.5,39.44
N$108
  Top 0.254: R15.1 32.2,39.29 C34.1 29.46,39.26 R14.2
N$109
  Top 0.254: C36.2 36.71,36.36 IC1.7 | C36.2 36.4,38.3 40.77,38.3 40.77,39.17 R18.2 | C34.2 R17.2 C36.2
N$110
  Top 0.254: IC1.6 39.03,37.62 39.7,37.62 40.59,36.73 40.59,35.71 C36.1 R17.1 30.5,35.69 30.12,36.07 R16.1
N$145
  Top 0.203: R9.1 37.76,22.37 | 37.76,22.37 C42.1 | 37.76,22.37 38.67,22.37 39.67,21.36 41.19,21.36 IC2.6
POT_A  (via drill 0.6)
  Top 0.203: R11.2 49.46,40.28 v50.47,41.83 | v11.66,28.27 12.52,29.13 DIG_POT.13
  Route15 0.203: v50.47,41.83 31.5,41.86
  Route15 0.254: 31.5,41.86 25.17,41.86 v11.66,28.27
RAW_REG_OUT
  Top 0.254: L7.1 15.38,17.93 U$1.17
REGOUT
  Top 0.203: U1.10 4.55,25.84 C23.1
RESET_N
  Top 0.203: C11.1 10.53,19.7 12.72,17.5 12.72,16.31 U$1.19
  Top 0.254: R1.1 9.19,22.55 C11.1
RF_P
  Top 0.127: C2.1 9.02,6.32 L3.1
  Top 0.203: U$1.1 10.24,9.03 C2.1
SHDWN_AL
  Top 0.254: DIG_POT.7 7.87,25.56 8.66,24.77 10.65,24.77 R28.1
VBATT
  Top 0.203: C55.1 12.78,38.35 U4.3
  Top 0.406: C55.1 16.52,39.97 DMP1045U.2
VCC/2  (via drill 0.6)
  Top 0.203: DIG_POT.11 DIG_POT.12 15.88,28.48 C31.1 | D2.1 27.18,15.32 | 27.18,15.32 27.18,12.19 | C44.1 46.58,17.48 48.21,15.85 48.21,14.15 48.39,13.97 50.22,13.97 52.05,12.14 52.05,10.95 51.24,10.14 C43.1 | IC2.1 IC2.2 48.96,20.13 C47.+ | R10.2 41.23,23.49 IC2.5 41.42,22.86 43.71,22.86 | 27.18,15.32 31.85,15.32 D1.1 30.62,14.1 v30.1,14.1 | R7.1 33.1,8.1 33.1,8.97 28.02,8.97 R34.2 28.02,11.35 27.18,12.19 | 27.18,12.19 27.18,10.9 23.09,10.9 23.09,9.63 R8.1 | 45.54,24.59 44.81,24.59 43.71,23.5 43.71,22.86 | 43.71,22.86 43.71,22.63 v43.36,22.28 | C39.2 34.28,29.02 v33.48,28.22 | 50.7,36.27 50.7,36.28 C40.2 50.7,37.88 v51,38.18 | C35.2 31.19,31.83 v31.14,31.83
  Top 0.254: C47.+ 47.7,24.59 C51.2 45.54,24.59 | 41.37,22.53 IC2.5 | IC2.1 46.58,18.86 C44.1 | C31.1 16,29.49 16.82,30.3 21.55,30.3 C30.2 22.98,29.36 25.48,31.85 25.48,34.39 | R13.2 23.58,35.17 23.88,34.87 24.49,34.87 R16.2 25.48,35.87 25.48,34.39 | 31.19,31.83 31.19,32.82 29.69,34.31 25.55,34.31 25.48,34.39
  Route2 0.203: v30.1,14.1 29.9,14.3 29.08,14.3 29.06,14.28 29.06,14.12 | v43.36,22.28 43.76,21.87 43.76,21.46 43.64,21.34 43.18,21.34 | v31.14,31.83 30.99,31.67 | v33.48,28.22 33.48,27.89 32.94,27.36 32.59,27.36 32.56,27.38 | v51,38.18 51,39.14 50.9,39.24
  Route2 0.254: 30.99,31.67 30.99,28.96 32.56,27.38
  pour Route2: 53.64,43.38 53.64,-0.15 22.73,-0.15 22.73,43.43
VCC/2_UNBUFF  (1 unrouted)
  Top 0.203: R23.2 46.15,12.5 45.06,12.5 | 45.06,12.5 43.1,12.5 45.55,10.05 R22.1 | IC2.3 45.56,21.4 45.01,20.85 45.01,12.55 45.06,12.5
VOUT  (via drill 0.6)
  Top 0.406: U6.5 20.01,38.78 v20.93,39.7 | v16.97,17.27 17.21,17.03 L6.1 | C57.1 18.06,33.68 v18.54,33.2
  Bottom 0.406: v20.93,39.7 20.93,35.59 v18.54,33.2 16.97,31.62 v16.97,17.27
X32K_Q1
  Top 0.127: U$1.4 11.74,9.21 C8.1 12.77,8.07 Q2.1
X32K_Q2
  Top 0.127: U$1.5 12.24,10.17 Q2.2 15.74,8.13 C9.1

### Text on the board
Top: make this thicker